# Altium schematic sheet Main_Power.SchDoc
size A4
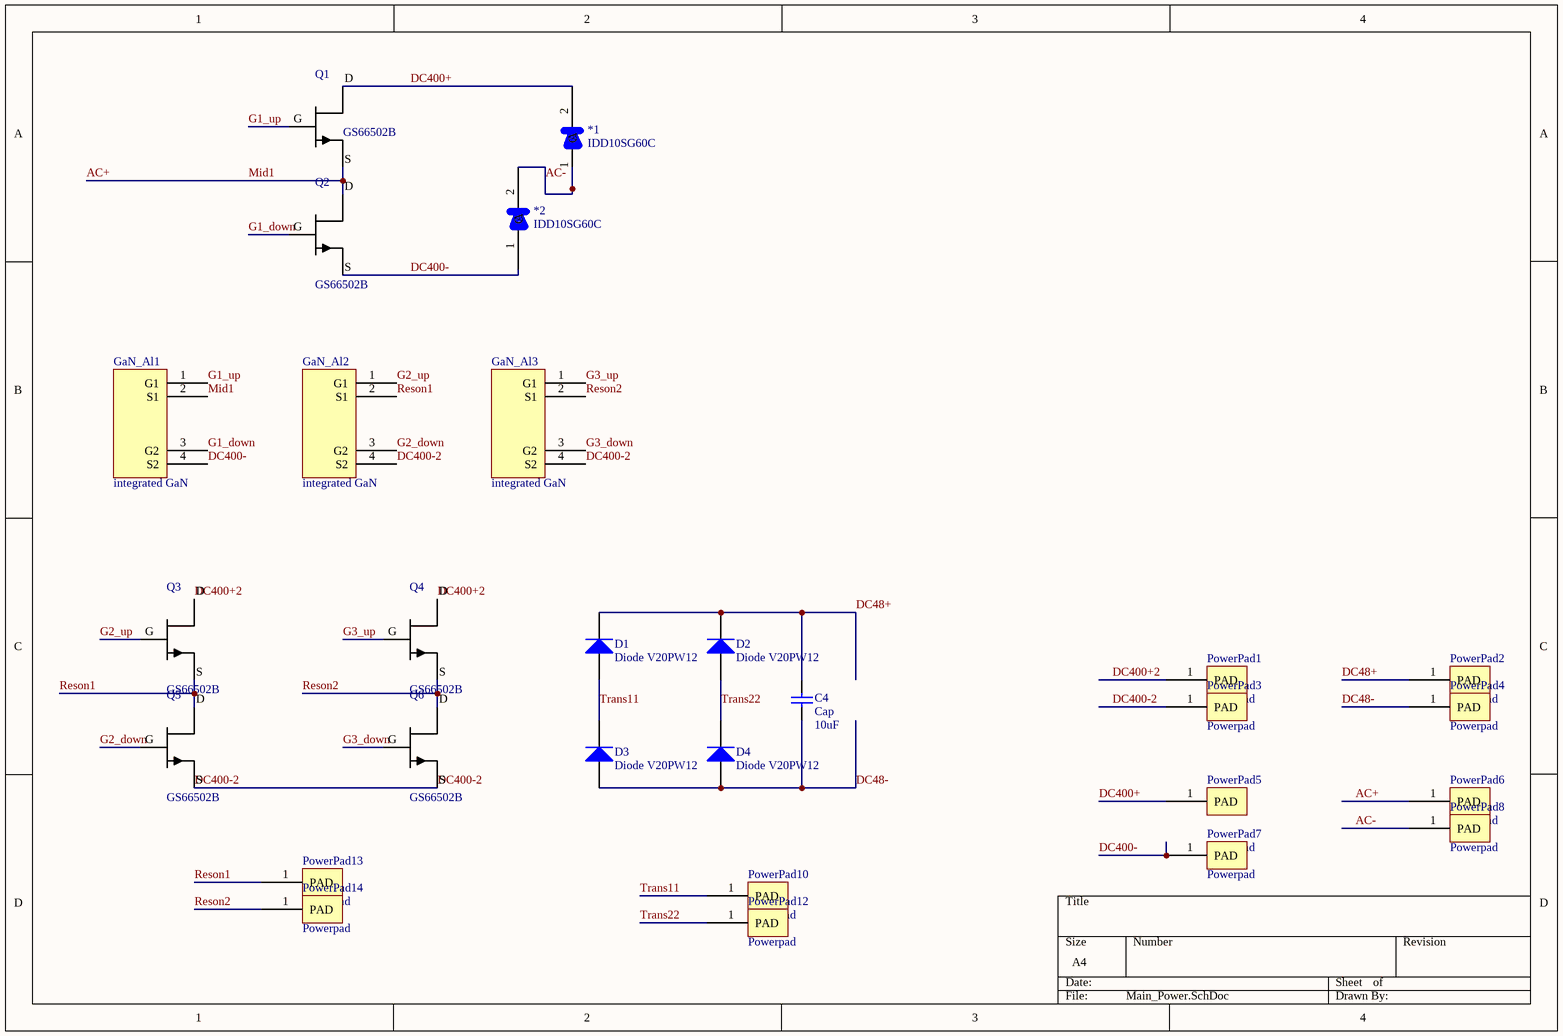
[diagram p0: Main_Power.SchDoc]

## Parts
*1  IDD10SG60C  [IDD10SG60C]
*2  IDD10SG60C  [IDD10SG60C]
C4  Cap  value 10uF  [C_Al]
D1  Diode V20PW12  [RFN20]
D2  Diode V20PW12  [RFN20]
D3  Diode V20PW12  [RFN20]
D4  Diode V20PW12  [RFN20]
GaN_Al1  integrated GaN  [GaN_driver]
GaN_Al2  integrated GaN  [GaN_driver]
GaN_Al3  integrated GaN  [GaN_driver]
PowerPad1  Powerpad  [POWERPAD]
PowerPad2  Powerpad  [POWERPAD]
PowerPad3  Powerpad  [POWERPAD]
PowerPad4  Powerpad  [POWERPAD]
PowerPad5  Powerpad  [POWERPAD]
PowerPad6  Powerpad  [POWERPAD]
PowerPad7  Powerpad  [POWERPAD]
PowerPad8  Powerpad  [POWERPAD]
PowerPad10  Powerpad  [POWERPAD]
PowerPad12  Powerpad  [POWERPAD]
PowerPad13  Powerpad  [POWERPAD]
PowerPad14  Powerpad  [POWERPAD]
Q1  GS66502B  [GS66502B]
Q2  GS66502B  [GS66502B]
Q3  GS66502B  [GS66502B]
Q4  GS66502B  [GS66502B]
Q5  GS66502B  [GS66502B]
Q6  GS66502B  [GS66502B]

## Nets
AC+: GaN_Al1.2(S1) PowerPad6.1(PAD) Q1.S Q2.D  [also labelled Mid1]
AC-: *1.1(A) *2.2(C) PowerPad8.1(PAD)
DC48+: C4.1 D1.2(K) D2.2(K) PowerPad2.1(PAD)
DC48-: C4.2 D3.1(A) D4.1(A) PowerPad4.1(PAD)
DC400+: *1.2(C) PowerPad5.1(PAD) Q1.D
DC400+2: PowerPad1.1(PAD) Q3.D Q4.D
DC400-: *2.1(A) GaN_Al1.4(S2) PowerPad7.1(PAD) Q2.S
DC400-2: GaN_Al2.4(S2) GaN_Al3.4(S2) PowerPad3.1(PAD) Q5.S Q6.S
G1_down: GaN_Al1.3(G2) Q2.G
G1_up: GaN_Al1.1(G1) Q1.G
G2_down: GaN_Al2.3(G2) Q5.G
G2_up: GaN_Al2.1(G1) Q3.G
G3_down: GaN_Al3.3(G2) Q6.G
G3_up: GaN_Al3.1(G1) Q4.G
Reson1: GaN_Al2.2(S1) PowerPad13.1(PAD) Q3.S Q5.D
Reson2: GaN_Al3.2(S1) PowerPad14.1(PAD) Q4.S Q6.D
Trans11: D1.1(A) D3.2(K) PowerPad10.1(PAD)
Trans22: D2.1(A) D4.2(K) PowerPad12.1(PAD)

## Library data of the parts
*1 *2 = IDD10SG60C: pin to pad: 1>2 2>3
C4 = Cap: Capacitor; Published: 8-Jun-2000; LatestRevisionDate: 17-Jul-2002; LatestRevisionNote: Re-released for DXP Platform.; PackageReference: RAD-0.3; Publisher: Altium Limited
D1-D4 = Diode: Default Diode; pin to pad: 1>2 2>3; Published: 8-Jun-2000; LatestRevisionDate: 17-Jul-2002; LatestRevisionNote: Re-released for DXP Platform.; PackageDocument: Sep-1996; PackageReference: SMC; Publisher: Altium Limited; Code_JEDEC: DO-214-AB
GaN_Al1-GaN_Al3 = GaN_Al
Q1-Q6 = GS66502B: GAN TRANS E-MODE 650V